# EAGLE design untitled_wifi (EAGLE 6.1)
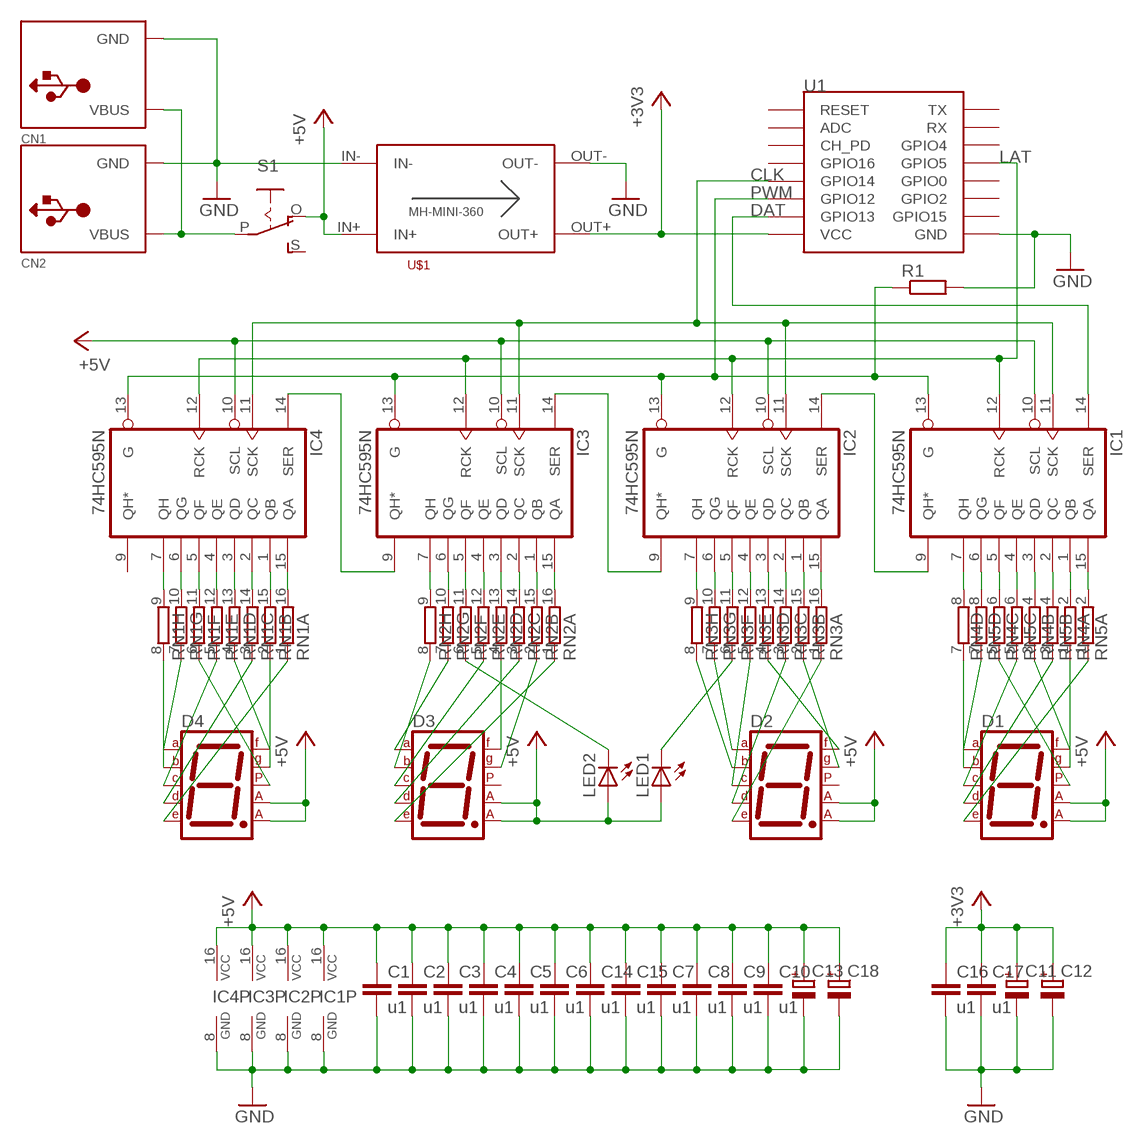
[diagram p0: schematic, sheet 1]

## Parts
C1  u1  C-EU025-025X050  [C025-025X050]
C2  u1  C-EU025-025X050  [C025-025X050]
C3  u1  C-EU025-025X050  [C025-025X050]
C4  u1  C-EU025-025X050  [C025-025X050]
C5  u1  C-EU025-025X050  [C025-025X050]
C6  u1  C-EU025-025X050  [C025-025X050]
C7  u1  C-EUC0805K  [C0805K]
C8  u1  C-EUC0805K  [C0805K]
C9  u1  C-EUC0805K  [C0805K]
C10  u1  C-EUC0805K  [C0805K]
C11  CPOL-EUTT2D4L  [TT2D4L]
C12  CPOL-EUTT2D4L  [TT2D4L]
C13  CPOL-EUE2.5-7  [E2,5-7]
C14  u1  C-EU025-025X050  [C025-025X050]
C15  u1  C-EU025-025X050  [C025-025X050]
C16  u1  C-EU025-025X050  [C025-025X050]
C17  u1  C-EU025-025X050  [C025-025X050]
C18  CPOL-EUE2.5-7  [E2,5-7]
CN1  USBPWR-ONLY  [USB-MINIB-THM]
CN2  USBPWR-ONLY  [USB-MINIB-THM]
D1  7SEG-CA  [7SEG-13]
D2  7SEG-CA  [7SEG-13]
D3  7SEG-CA  [7SEG-13]
D4  7SEG-CA  [7SEG-13]
IC1  74HC595N  [DIL16]
IC2  74HC595N  [DIL16]
IC3  74HC595N  [DIL16]
IC4  74HC595N  [DIL16]
LED1  LED3MM  [LED3MM]
LED2  LED3MM  [LED3MM]
R1  R-EU_0204/7  [0204/7]
RN1  8R-N  [DIL16]
RN2  8R-N  [DIL16]
RN3  8R-N  [DIL16]
RN4  E4R  [SIL8]
RN5  E4R  [SIL8]
S1  EG1218S  [EG1218]
U1  ESP12EDIP  [ESP-12-BREAKOUT]
U$1  DC-DC_CONV_MINISTD  [DC-DC_CONV_MINI]

## Nets
+3V3: C11.+ C12.+ C16.1 C17.1 U1.P$1(VCC) U$1.OUT+
+5V: C1.1 C2.1 C3.1 C4.1 C5.1 C6.1 C7.1 C8.1 C9.1 C10.1 C13.+ C14.1 C15.1 C18.+ D1.3(CA1) D1.8(CA2) D2.3(CA1) D2.8(CA2) D3.3(CA1) D3.8(CA2) D4.3(CA1) D4.8(CA2) IC1.10(SCL) IC1.16(VCC) IC2.10(SCL) IC2.16(VCC) IC3.10(SCL) IC3.16(VCC) IC4.10(SCL) IC4.16(VCC) LED1.A LED2.A S1.O U$1.IN+
CLK: IC1.11(SCK) IC2.11(SCK) IC3.11(SCK) IC4.11(SCK) U1.P$4(GPIO14)
DAT: IC1.14(SER) U1.P$2(GPIO13)
GND: C1.2 C2.2 C3.2 C4.2 C5.2 C6.2 C7.2 C8.2 C9.2 C10.2 C11.- C12.- C13.- C14.2 C15.2 C16.2 C17.2 C18.- CN1.GND CN1.GND1(GND) CN1.GND2(GND) CN1.GND3(GND) CN1.GND4(GND) CN2.GND CN2.GND1(GND) CN2.GND2(GND) CN2.GND3(GND) CN2.GND4(GND) IC1.8(GND) IC2.8(GND) IC3.8(GND) IC4.8(GND) R1.2 U1.P$9(GND) U$1.IN- U$1.OUT-
LAT: IC1.12(RCK) IC2.12(RCK) IC3.12(RCK) IC4.12(RCK) U1.P$13(GPIO5)
N$1: D1.7(A) RN5.7
N$2: D1.6(B) RN4.7
N$3: D1.5(DP) RN4.5
N$4: D1.4(C) RN5.5
N$5: D1.9(F) RN4.3
N$6: D1.2(D) RN5.3
N$7: D1.10(G) RN4.1
N$8: D1.1(E) RN5.1
N$9: D4.9(F) RN1.4
N$10: D2.1(E) RN3.1
N$11: D2.2(D) RN3.3
N$12: D2.4(C) RN3.5
N$13: D2.7(A) RN3.7
N$14: D2.6(B) RN3.8
N$15: LED2.K(C) RN2.6
N$16: D2.9(F) RN3.4
N$17: D2.10(G) RN3.2
N$18: D3.1(E) RN2.1
N$19: D3.2(D) RN2.3
N$20: D3.4(C) RN2.5
N$21: D3.7(A) RN2.7
N$22: D3.6(B) RN2.8
N$23: LED1.K(C) RN3.6
N$24: D3.9(F) RN2.4
N$25: D3.10(G) RN2.2
N$26: D4.1(E) RN1.1
N$27: D4.2(D) RN1.3
N$28: D4.4(C) RN1.5
N$29: D4.7(A) RN1.7
N$30: IC1.9(QH*) IC2.14(SER)
N$31: IC2.9(QH*) IC3.14(SER)
N$32: IC3.9(QH*) IC4.14(SER)
N$33: IC1.7(QH) RN4.8
N$34: IC1.15(QA) RN5.2
N$35: IC1.1(QB) RN4.2
N$36: IC1.2(QC) RN5.4
N$37: IC1.3(QD) RN4.4
N$38: IC1.4(QE) RN5.6
N$39: IC1.5(QF) RN4.6
N$40: IC1.6(QG) RN5.8
N$41: IC2.7(QH) RN3.9
N$42: IC2.15(QA) RN3.16
N$43: D4.6(B) RN1.8
N$44: D4.5(DP) RN1.6
N$45: D4.10(G) RN1.2
N$46: CN1.VBUS CN2.VBUS S1.P
N$50: IC3.15(QA) RN2.16
N$53: IC3.3(QD) RN2.13
N$55: IC3.5(QF) RN2.11
N$62: IC3.7(QH) RN2.9
N$76: IC4.7(QH) RN1.9
N$77: IC4.5(QF) RN1.11
N$78: IC4.6(QG) RN1.10
N$79: IC4.4(QE) RN1.12
N$80: IC4.3(QD) RN1.13
N$81: IC4.2(QC) RN1.14
N$82: IC4.1(QB) RN1.15
N$83: IC4.15(QA) RN1.16
N$91: IC2.1(QB) RN3.15
N$92: IC2.2(QC) RN3.14
N$93: IC2.3(QD) RN3.13
N$94: IC2.4(QE) RN3.12
N$95: IC2.5(QF) RN3.11
N$96: IC2.6(QG) RN3.10
N$97: IC3.1(QB) RN2.15
N$98: IC3.2(QC) RN2.14
N$99: IC3.4(QE) RN2.12
N$100: IC3.6(QG) RN2.10
PWM: IC1.13(G) IC2.13(G) IC3.13(G) IC4.13(G) R1.1 U1.P$3(GPIO12)
Unconnected: D2.5(DP) D3.5(DP) IC4.9(QH*) S1.S U1.P$5(GPIO16) U1.P$6(CH_PD) U1.P$7(ADC) U1.P$8(RESET) U1.P$10(GPIO15) U1.P$11(GPIO2) U1.P$12(GPIO0) U1.P$14(GPIO4) U1.P$15(RX) U1.P$16(TX)

## Library data of the parts
C1-C10 C14-C17 = rcl:C-EU: CAPACITOR, European symbol
C11-C13 C18 = rcl:CPOL-EU: POLARIZED CAPACITOR, European symbol
CN1 CN2 = _MY_OWN_LIB:USB: USB Connectors USBMINIB - Surface Mount Female Mini-B USB Connector 4UConnector: 06564 By microbuilder.eu Thru-hole RA Female Mini-B USB Connector 4UConnector: 18732 By ladyada.net
D1-D4 = special:7SEG-CA: 7-segment DISPLAY single anode, 13 mm
IC1-IC4 = 74xx-eu:74*595: 8-bit SHIFT REGISTER, output latch
LED1 LED2 = led:LED: LED OSRAM: - CHIPLED LG R971, LG N971, LY N971, LG Q971, LY Q971, LO R971, LY R971 LH N974, LH R974 LS Q976, LO Q976, LY Q976 LO Q996 - Hyper CHIPLED LW Q18S LB Q993, LB Q99A, LB R99A - SideLED LS A670, LO A670, LY A670, LG A670, LP A670 LB A673, LV A673, LT A673, LW A673 LH A674 LY A675 LS A676, LA A676, LO A676, LY A676, LW A676 LS A679, LY A679, LG A679 - Hyper Micro SIDELED® LS Y876, LA Y876, LO Y876, LY Y876 LT Y87S - SmartLED LW L88C, LW L88S LB L89C, LB L89S, LG L890 LS L89K, LO L89K, LY L89K LS L896, LA L896, LO L896, LY L896 - TOPLED LS T670, LO T670, LY T670, LG T670, LP T670 LSG T670, LSP T670, LSY T670, LOP T670, LYG T670 LG T671, LOG T671, LSG T671 LB T673, LV T673, LT T673, LW T673 LH T674 LS T676, LA T676, LO T676, LY T676, LB T676, LH T676, LSB T676, LW T676 LB T67C, LV T67C, LT T67C, LS T67K, LO T67K, LY T67K, LW E67C LS E67B, LA E67B, LO E67B, LY E67B, LB E67C, LV E67C, LT E67C LW T67C LS T679, LY T679, LG T679 LS T770, LO T770, LY T770, LG T770, LP T770 LB T773, LV T773, LT T773, LW T773 LH T774 LS E675, LA E675, LY E675, LS T675 LS T776, LA T776, LO T776, LY T776, LB T776 LHGB T686 LT T68C, LB T68C - Hyper Mini TOPLED® LB M676 - Mini TOPLED Santana® LG M470 LS M47K, LO M47K, LY M47K Source: http://www.osram.convergy.de LUXEON: - LUMILED® LXK2-PW12-R00, LXK2-PW12-S00, LXK2-PW14-U00, LXK2-PW14-V00 LXK2-PM12-R00, LXK2-PM12-S00, LXK2-PM14-U00 LXK2-PE12-Q00, LXK2-PE12-R00, LXK2-PE12-S00, LXK2-PE14-T00, LXK2-PE14-U00 LXK2-PB12-K00, LXK2-PB12-L00, LXK2-PB12-M00, LXK2-PB14-N00, LXK2-PB14-P00, LXK2-PB14-Q00 LXK2-PR12-L00, LXK2-PR12-M00, LXK2-PR14-Q00, LXK2-PR14-R00 LXK2-PD12-Q00, LXK2-PD12-R00, LXK2-PD12-S00 LXK2-PH12-R00, LXK2-PH12-S00 LXK2-PL12-P00, LXK2-PL12-Q00, LXK2-PL12-R00 Source: www.luxeon.com KINGBRIGHT: KA-3528ASYC Source: www.kingbright.com
R1 = rcl:R-EU_: RESISTOR, European symbol
RN1-RN3 = resistor-dil:8R-N: DIL RESISTOR; OC_FARNELL: unknown; OC_NEWARK: unknown
RN4 RN5 = resistor-sil:E4R: SIL RESISTOR; OC_FARNELL: unknown; OC_NEWARK: unknown
S1 = _MY_OWN_LIB:EG1218: SLIDING SWITCH 0.1" spacing through hole, vertical SPDT slide switch http://www.ladyada.net/library/pcb/eaglelibrary.html
U1 = _MY_OWN_LIB:ESP12E: ESP12E Module
U$1 = _MY_OWN_LIB:DC-DC_CONV_MINI

## Board
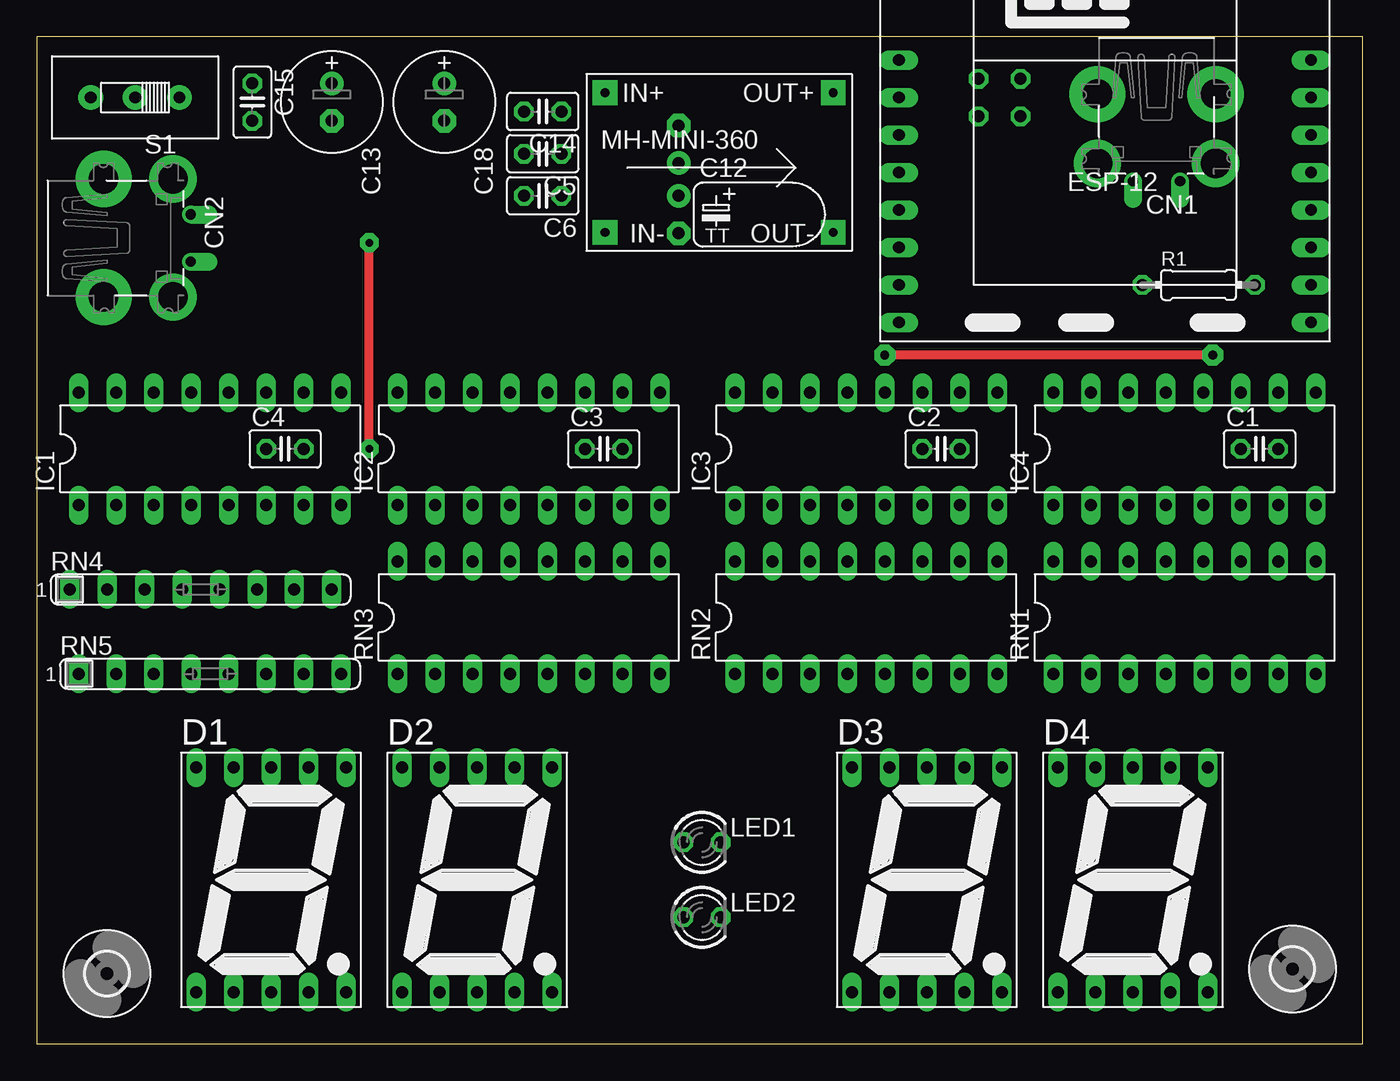
[diagram p1: board, top side]
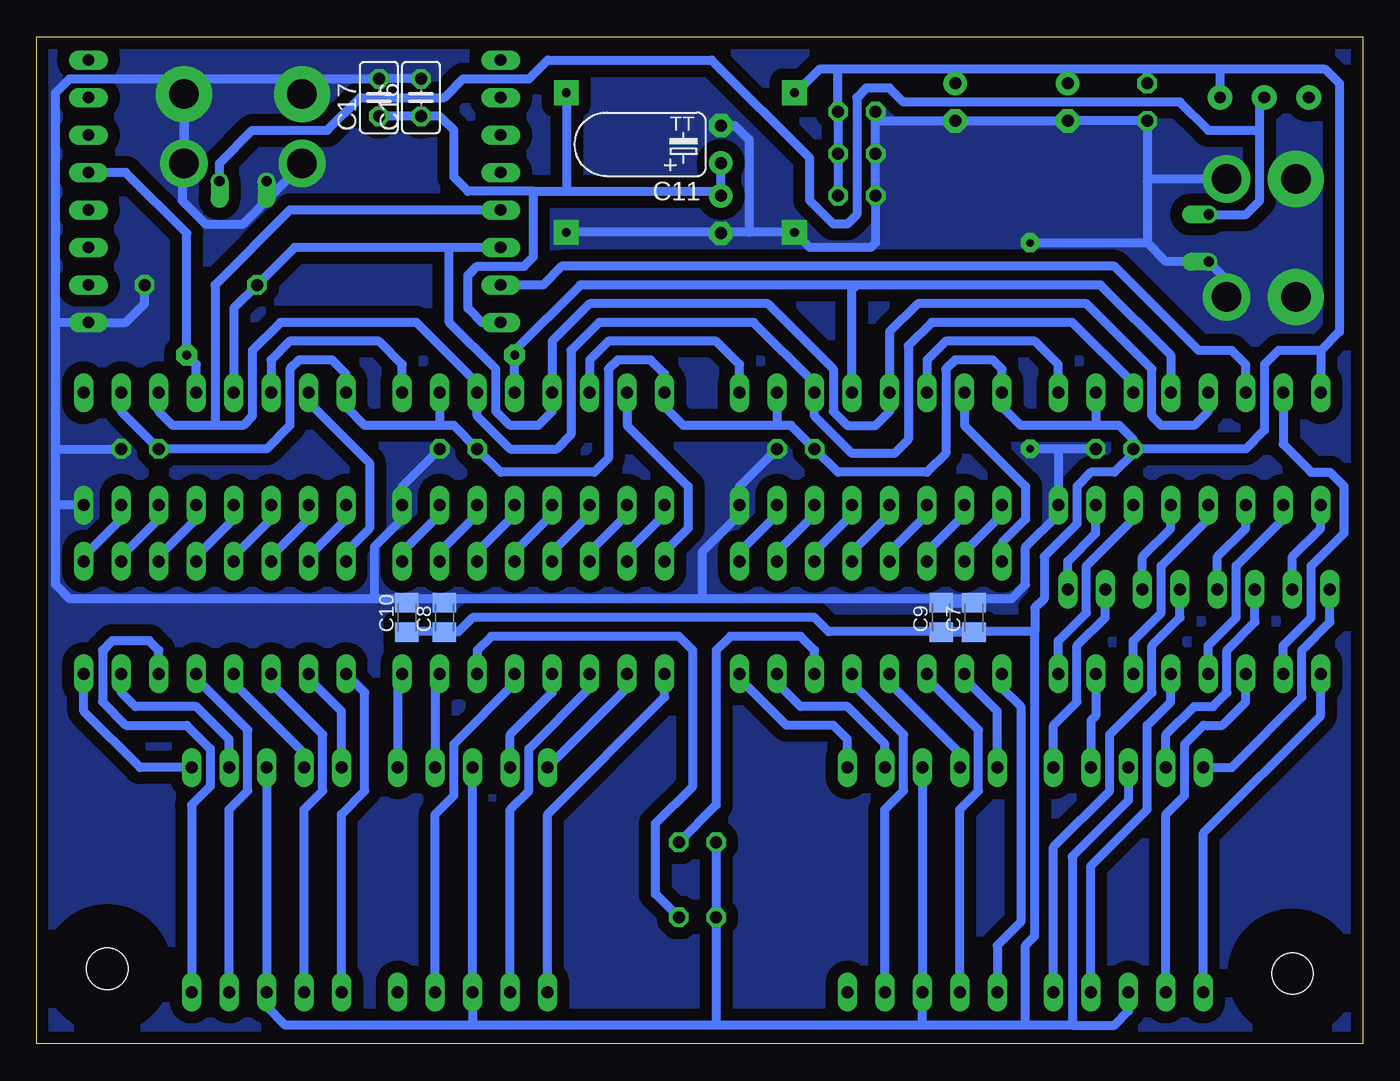
[diagram p2: board, bottom side, seen from below]

Size 89.84 x 68.24 mm. Coordinates in mm from the lower left corner, seen from the top.
Outline: 89.84,0 89.84,68.24 0,68.24 0,0 89.84,0
Copper layers (1*16): Top 0.035mm / dielectric 1.5mm / Bottom 0.035mm
Design rules: minimum track width 10mil, minimum drill 24mil, track to track 12mil, track to pad 12mil, pad to pad 12mil, via to via 12mil, smd to smd 10mil, copper to edge 12mil, drill to drill 12mil, minimum pad ring 10mil, minimum via ring 10mil, stop-mask expansion 4mil, vias tented up to drill 0mil, thermal gap 12mil

### Footprints (pad centres in the part's own frame; a part is rotated, then mirrored left to right if it is on the bottom)
C025-025X050 = drill 0.813 octagon: 1 -1.27,0; 2 1.27,0
C0805K = smd 1.3 x 1.6: 1 -1,0; 2 1,0
TT2D4L = drill 0.813 pad 1.6: + -1.27,0 | drill 0.813 pad 1.6 octagon: - 1.27,0
E2,5-7 = drill 0.813 pad 1.6: + -1.27,0 | drill 0.813 pad 1.6 octagon: - 1.27,0
USB-MINIB-THM = drill 0.7 offset: GND 1.6,9.8; VBUS -1.6,9.8 | drill 2 pad 3.81: GND1 -4,3.9; GND4 4,3.9 | drill 2 pad 3.2: GND2 -4,8.6; GND3 4,8.6
7SEG-13 = drill 0.813 long: 1 -5.08,-7.62; 2 -2.54,-7.62; 3 0,-7.62; 4 2.54,-7.62; 5 5.08,-7.62; 6 5.08,7.62; 7 2.54,7.62; 8 0,7.62; 9 -2.54,7.62; 10 -5.08,7.62
DIL16 = drill 0.813 long: 1 -8.89,-3.81; 2 -6.35,-3.81; 3 -3.81,-3.81; 4 -1.27,-3.81; 5 1.27,-3.81; 6 3.81,-3.81; 7 6.35,-3.81; 8 8.89,-3.81; 9 8.89,3.81; 10 6.35,3.81; 11 3.81,3.81; 12 1.27,3.81; 13 -1.27,3.81; 14 -3.81,3.81; 15 -6.35,3.81; 16 -8.89,3.81
LED3MM = drill 0.813 octagon: A -1.27,0; K 1.27,0
0204/7 = drill 0.813 octagon: 1 -3.81,0; 2 3.81,0
SIL8 = drill 0.813 long: 1 -8.89,0; 2 -6.35,0; 3 -3.81,0; 4 -1.27,0; 5 1.27,0; 6 3.81,0; 7 6.35,0; 8 8.89,0
EG1218 = drill 0.8 pad 1.676: O -3,0; P 0,0; S 3,0
ESP-12-BREAKOUT = drill 0.8 long: P$1 0,0; P$2 0,2.54; P$3 0,5.08; P$4 0,7.62; P$5 0,10.16; P$6 0,12.7; P$7 0,15.24; P$8 0,17.78; P$9 27.94,0; P$10 27.94,2.54; P$11 27.94,5.08; P$12 27.94,7.62; P$13 27.94,10.16; P$14 27.94,12.7; P$15 27.94,15.24; P$16 27.94,17.78
DC-DC_CONV_MINI = drill 0.6 pad 1.676 square: IN+ 16.73,1.27; IN- 16.73,10.73; OUT+ 1.27,1.27; OUT- 1.27,10.73
2,8 = hole 2.8: 0,0

### Placement (x,y rotation side)
C1  82.86,40.32 0 top
C2  61.27,40.32 0 top
C3  38.41,40.32 0 top
C4  16.81,40.32 0 top
C5  34.28,60.33 180 top
C6  34.28,57.47 180 top
C7  26.34,28.89 90 bottom
C8  62.22,28.89 90 bottom
C9  28.56,28.89 90 bottom
C10  64.76,28.89 90 bottom
C11  43.48,60.96 90 bottom
C12  43.48,56.2 270 top
C13  19.99,63.82 270 top
C14  34.28,63.18 180 top
C15  14.59,63.82 270 top
C16  63.8,64.14 90 bottom
C17  66.66,64.14 90 bottom
C18  27.61,63.82 270 top
CN1  75.87,68.26 180 top
CN2  0.62,54.61 270 top
D1  15.86,11.11 0 top
D2  29.83,11.11 0 top
D3  60.31,11.11 0 top
D4  74.28,11.11 0 top
IC1  11.74,40.32 0 top
IC2  33.33,40.32 0 top
IC3  56.19,40.32 0 top
IC4  77.78,40.32 0 top
LED1  45.07,13.65 0 top
LED2  45.07,8.57 0 top
R1  78.73,51.44 0 top
RN1  77.78,28.89 0 top
RN2  56.19,28.89 0 top
RN3  33.33,28.89 0 top
RN4  11.1,30.8 0 top
RN5  11.74,25.08 0 top
S1  6.65,64.14 180 top
U1  58.41,48.9 0 top
U$1  55.23,65.72 180 top
U$2  [2,8]  4.75,4.76 0 top
U$3  [2,8]  85.08,5.08 0 top

### Tracks (layer width: path | path; a pad name or v marks a point on that pad's centre or on a via)
+3V3
  Bottom 0.61: U1.P$1 59.68,48.9 60.63,49.85 60.63,52.07 60,52.7 56.82,52.7 56.18,53.34 56.18,57.78 | C11.+ C12.+ 43.8,57.78 53.96,57.78 | 56.18,57.78 53.96,57.78 | 56.18,57.78 60.63,57.78 61.58,58.74 61.58,61.91 62.54,62.87 C16.1 C17.1 | U$1.OUT+ 53.96,57.78
+5V
  Bottom 0.61: 2.85,46.99 IC1.16 | D1.8 15.86,16.51 19.67,12.7 19.67,1.27 | 19.67,1.27 16.81,1.27 15.86,2.22 D1.3 | 22.85,1.27 29.83,1.27 | 29.83,1.27 D2.3 D2.8 | 29.83,1.27 43.8,1.27 | 43.8,1.27 60.31,1.27 | 60.31,1.27 D3.3 D3.8 | D4.8 D4.3 74.28,2.54 73.01,1.27 60.31,1.27 | LED2.A LED1.A 43.8,1.27 | C4.1 15.54,40.01 16.81,38.73 18.4,38.73 19.36,37.78 19.36,35.24 21.58,33.02 21.58,30.16 22.21,29.53 22.21,27.94 | 19.67,1.27 22.85,1.27 | 22.85,1.27 22.85,6.67 22.21,7.3 22.21,27.94 | 2.85,46.99 5.7,46.99 6.65,46.04 6.65,41.59 7.93,40.32 C4.1 | C4.1 15.54,40.96 16.5,41.91 18.08,41.91 | 18.08,41.91 23.17,41.91 24.43,43.18 IC2.16 24.43,45.72 25.07,46.35 27.61,46.35 28.24,45.72 28.24,40.01 29.51,38.73 35.55,38.73 C3.1 38.72,41.91 39.68,41.91 | IC1.10 18.08,41.91 | 39.68,41.91 46.03,41.91 47.29,43.18 IC3.16 47.29,45.4 48.25,46.35 50.47,46.35 51.11,45.72 51.11,39.69 52.06,38.73 58.41,38.73 C2.1 61.58,41.91 62.54,41.91 | IC2.10 39.68,41.91 | 62.54,41.91 67.62,41.91 68.89,43.18 IC4.16 68.89,45.4 69.84,46.35 72.06,46.35 72.7,45.72 72.7,41.91 74.28,40.32 C1.1 84.12,42.86 IC4.10 | IC3.10 62.54,41.91 | 22.21,27.94 28.56,27.94 | 28.56,27.94 36.18,27.94 37.14,28.89 60.31,28.89 61.26,27.94 62.17,27.94 | 62.17,27.94 64.76,27.94 C10.1 | 28.56,27.94 28.51,27.89 C7.1 C9.1 | 62.17,27.94 C8.1 | 2.85,46.99 1.58,48.26 1.58,65.09 2.53,66.04 9.51,66.04 | U$1.IN+ 38.4,64.45 36.82,66.04 35.55,66.04 | C6.1 C5.1 C14.1 35.55,66.04 | 9.51,66.04 14.59,66.04 | 14.59,66.04 19.99,66.04 | 19.99,66.04 27.61,66.04 | 27.61,66.04 35.55,66.04 | C18.+ 27.61,66.04 | C13.+ 19.99,66.04 | C15.1 14.59,66.04 | S1.O 9.66,65.9 9.51,66.04
CLK
  Bottom 0.61: IC1.11 15.54,44.77 19.67,48.9 29.2,48.9 30.79,47.31 30.79,40.96 31.74,40.01 34.59,40.01 37.14,42.55 IC2.11 37.14,44.77 41.26,48.9 51.74,48.9 53.65,46.99 53.65,41.27 54.6,40.32 57.77,40.32 60,42.55 IC3.11 60,44.77 64.12,48.9 73.33,48.9 75.23,46.99 75.23,42.55 75.87,41.91 77.78,41.91 | 77.78,41.91 80.63,41.91 81.59,42.86 IC4.11 | U1.P$4 72.7,56.52 77.78,51.44 77.78,41.91
DAT
  Bottom 0.61: IC1.14 7.93,46.04 8.88,46.99 11.1,46.99 16.81,52.7 54.28,52.7 55.55,51.44 U1.P$2
GND  (via drill 0.5 pad 1.27)
  Top 0.61: v22.53,40.32 v22.53,54.29
  Bottom 0.61: C3.2 42.22,37.78 IC2.8 42.22,35.88 44.76,33.34 44.76,30.16 | 66.98,30.16 66.98,33.66 65.08,35.56 IC3.8 65.08,37.78 C2.2 | 66.98,30.16 87.62,30.16 88.57,31.11 88.57,36.51 | 44.76,30.16 62.22,30.16 | 62.22,30.16 64.76,30.16 | 64.76,30.16 66.98,30.16 | 26.34,30.16 23.8,30.16 22.85,31.11 22.85,33.66 20.63,35.88 IC1.8 20.63,40.32 | 26.34,30.16 44.76,30.16 | IC4.8 88.57,36.51 | C9.2 C7.2 26.34,30.16 | C8.2 62.22,30.16 | C10.2 64.76,30.16 | R1.2 82.54,50.16 83.81,48.9 U1.P$9 88.57,48.9 | 88.57,40.32 C1.2 | 88.57,36.51 88.57,40.32 | 88.57,40.32 88.57,48.9 | 88.57,48.9 88.57,64.45 87.62,65.41 79.68,65.41 | 79.68,65.41 72.06,65.41 | 72.06,65.41 C17.2 C16.2 | 41.58,54.99 U$1.IN- 38.4,55.09 | 41.58,54.99 43.48,54.99 | 43.48,54.99 53.9,54.99 53.96,54.93 | C12.- 43.48,54.99 | C4.2 20.63,40.32 | CN2.GND 10.42,52.98 9.19,51.75 9.19,50.64 CN2.GND3 | 41.58,54.99 41.58,61.28 42.53,62.23 C11.- | 38.4,54.93 37.45,53.98 33.33,53.98 33.01,54.29 C6.2 C5.2 C14.2 33.01,62.55 C18.- C13.- C15.2 14.59,58.42 | 14.59,54.29 13.32,53.02 10.78,53.02 | 14.59,58.42 14.59,54.29 | 20.63,40.32 v22.53,40.32 | v22.53,54.29 14.59,54.29 | CN2.GND2 14.4,58.61 14.59,58.42 | CN1.GND4 71.87,65.22 72.06,65.41 | CN1.GND1 79.87,59.82 80,59.69 80,57.15 78.41,55.56 75.87,55.56 73.65,57.78 | CN1.GND2 79.87,65.22 79.68,65.41 | 73.65,57.78 71.87,59.56 CN1.GND3 | CN1.GND 74.27,58.41 73.65,57.78
  pour Bottom (isolate 0.813, no thermals): -0.01,0 89.84,0 89.84,68.26 -0.01,68.26
LAT  (via drill 0.6 pad 1.42)
  Top 0.61: v79.68,46.67 v57.46,46.67
  Bottom 0.61: IC3.12 v57.46,46.67 57.46,46.99 53.01,51.44 34.59,51.44 | U1.P$13 83.81,59.05 79.68,54.93 v79.68,46.67 79.04,46.04 IC4.12 | 34.28,51.44 17.77,51.44 13.01,46.67 IC1.12 | 34.28,51.44 34.59,51.44 | 34.59,51.44 34.59,51.12 | IC2.12 34.59,51.12 | 34.59,51.12 34.28,51.44
N$1
  Bottom 0.61: RN5.7 18.08,22.23 18.4,21.91 D1.7
N$2
  Bottom 0.61: D1.6 20.94,21.59 19.36,23.18 19.36,26.99 17.45,28.89 RN4.7
N$3
  Bottom 0.61: D1.5 20.94,13.34 17.13,17.14 17.13,20.95 14.27,23.81 14.27,26.99 12.37,28.89 RN4.5
N$4
  Bottom 0.61: D1.4 18.4,12.06 14.59,15.88 14.59,21.59 13.01,23.18 RN5.5
N$5
  Bottom 0.61: D1.9 13.32,20.95 11.42,22.86 10.15,22.86 9.19,23.81 9.19,26.67 7.29,28.57 RN4.3
N$6
  Bottom 0.61: D1.2 13.32,15.56 12.05,16.83 12.05,20.32 10.78,21.59 9.51,21.59 7.93,23.18 RN5.3
N$7
  Bottom 0.61: D1.10 8.88,18.73 4.12,23.5 4.12,26.67 2.21,28.57 RN4.1
N$8
  Bottom 0.61: D1.1 10.78,14.29 2.85,22.23 RN5.1
N$9
  Bottom 0.61: D4.9 71.74,19.68 76.5,24.45 RN1.4
N$10
  Bottom 0.61: RN3.1 24.43,24.13 23.17,22.86 23.17,8.26 24.75,6.67 D2.1
N$11
  Bottom 0.61: D2.2 27.29,15.88 26.02,17.14 26.02,21.27 29.51,24.77 RN3.3
N$12
  Bottom 0.61: D2.4 32.37,15.88 31.1,17.14 31.1,20.95 34.59,24.45 RN3.5
N$13
  Bottom 0.61: D2.7 32.37,20.32 34.91,22.86 38.09,22.86 39.68,24.45 RN3.7
N$14
  Bottom 0.61: D2.6 34.91,20.64 35.86,21.59 39.04,21.59 42.22,24.77 RN3.8
N$15
  Bottom 0.61: LED2.K 47.93,10.16 47.93,14.92 45.39,17.46 45.39,26.67 46.34,27.62 59.04,27.62 60,26.67 RN2.6
N$16
  Bottom 0.61: D2.9 27.29,19.68 32.06,24.45 RN3.4 32.06,24.77
N$17
  Bottom 0.61: D2.10 24.75,22.54 26.97,24.77 RN3.2
N$18
  Bottom 0.61: D3.1 55.23,15.56 47.29,23.5 RN2.1
N$19
  Bottom 0.61: D3.2 57.77,15.88 56.5,17.14 56.5,20 52.37,24.13 RN2.3
N$20
  Bottom 0.61: D3.4 62.85,15.56 61.58,16.83 61.58,20.32 57.46,24.45 RN2.5
N$21
  Bottom 0.61: RN2.7 62.85,24.77 D3.7
N$22
  Bottom 0.61: RN2.8 65.39,24.77 D3.6
N$23
  Bottom 0.61: RN3.6 37.14,26.67 38.09,27.62 42.85,27.62 43.8,26.67 43.8,16.19 LED1.K
N$24
  Bottom 0.61: D3.9 57.77,20.95 54.91,23.81 RN2.4
N$25
  Bottom 0.61: D3.10 49.83,24.13 RN2.2
N$26
  Bottom 0.61: D4.1 69.2,15.56 67.62,17.14 67.62,23.81 RN1.1
N$27
  Bottom 0.61: D4.2 71.74,15.88 70.47,17.14 70.47,20.95 73.97,24.45 RN1.3
N$28
  Bottom 0.61: D4.4 76.82,15.88 75.55,17.14 75.55,21.27 79.04,24.77 RN1.5
N$29
  Bottom 0.61: D4.7 76.82,20.64 79.04,22.86 83.17,22.86 84.12,23.81 RN1.7
N$30
  Bottom 0.61: IC1.9 20.63,46.04 22.21,47.62 28.24,47.62 29.51,46.35 IC2.14
N$31
  Bottom 0.61: IC2.9 42.22,46.04 43.8,47.62 51.11,47.62 52.37,46.35 IC3.14
N$32
  Bottom 0.61: IC3.9 65.08,46.04 66.66,47.62 72.7,47.62 73.97,46.35 IC4.14
N$33
  Bottom 0.61: RN4.8 19.99,32.7 18.08,34.61 IC1.7
N$34
  Bottom 0.61: IC1.15 5.39,40.64 3.48,38.73 2.21,38.73 1.26,37.78 1.26,34.61 3.48,32.38 3.48,28.89 5.39,26.99 RN5.2
N$35
  Bottom 0.61: RN4.2 4.75,33.02 2.85,34.92 IC1.1
N$36
  Bottom 0.61: RN5.4 10.46,26.99 8.56,28.89 8.56,32.38 5.39,35.56 IC1.2
N$37
  Bottom 0.61: RN4.4 9.83,33.02 7.93,34.92 IC1.3
N$38
  Bottom 0.61: RN5.6 15.54,27.3 13.64,29.21 13.64,32.38 10.46,35.56 IC1.4
N$39
  Bottom 0.61: RN4.6 14.91,33.02 13.01,34.92 IC1.5
N$40
  Bottom 0.61: RN5.8 20.63,27.3 18.72,29.21 18.72,32.38 15.54,35.56 IC1.6
N$41
  Bottom 0.61: RN3.9 42.22,33.34 39.68,35.88 IC2.7
N$42
  Bottom 0.61: IC2.15 26.97,41.91 22.85,37.78 22.85,35.56 24.43,33.97 RN3.16
N$43
  Bottom 0.61: D4.6 82.86,18.73 86.67,22.54 RN1.8
N$44
  Bottom 0.61: RN1.6 81.59,26.67 82.22,27.3 84.76,27.3 85.39,26.67 85.39,23.18 83.81,21.59 79.68,21.59 78.09,20 78.09,17.46 79.36,16.19 D4.5
N$45
  Bottom 0.61: D4.10 69.2,22.54 71.42,24.77 RN1.2
N$46
  Bottom 0.61: S1.P 6.97,63.82 6.97,61.91 | CN1.VBUS 77.47,59.68 75.23,61.91 70.15,61.91 67.93,64.14 62.22,64.14 60.95,65.41 56.5,65.41 55.23,66.67 44.12,66.67 37.45,60.01 37.45,57.15 35.86,55.56 34.91,55.56 34.28,56.2 34.28,64.14 33.64,64.77 32.06,64.77 31.1,63.82 12.37,63.82 10.46,61.91 6.97,61.91 | CN2.VBUS 7.91,56.21 6.97,57.15 6.97,61.91
N$50
  Bottom 0.61: IC3.15 49.83,41.91 45.71,37.78 45.71,34.92 47.29,33.34 RN2.16
N$53
  Bottom 0.61: RN2.13 54.91,33.34 52.37,35.88 IC3.3
N$55
  Bottom 0.61: RN2.11 60,33.34 57.46,35.88 IC3.5
N$62
  Bottom 0.61: RN2.9 65.08,33.34 62.54,35.88 IC3.7
N$76
  Bottom 0.61: RN1.9 86.67,33.02 84.12,35.56 IC4.7
N$77
  Bottom 0.61: RN1.11 81.59,33.02 79.04,35.56 IC4.5
N$78
  Bottom 0.61: RN1.10 84.12,33.02 81.59,35.56 IC4.6
N$79
  Bottom 0.61: RN1.12 79.04,33.02 76.5,35.56 IC4.4
N$80
  Bottom 0.61: RN1.13 76.5,33.02 73.97,35.56 IC4.3
N$81
  Bottom 0.61: RN1.14 73.97,33.02 71.42,35.56 IC4.2
N$82
  Bottom 0.61: RN1.15 71.42,33.02 68.89,35.56 IC4.1
N$83
  Bottom 0.61: IC4.15 71.42,43.5 67.3,39.37 67.3,34.92 68.89,33.34 RN1.16
N$91
  Bottom 0.61: RN3.15 26.97,33.34 24.43,35.88 IC2.1
N$92
  Bottom 0.61: IC2.2 26.97,35.88 29.51,33.34 RN3.14
N$93
  Bottom 0.61: RN3.13 32.06,33.34 29.51,35.88 IC2.3
N$94
  Bottom 0.61: RN3.12 34.59,33.34 32.06,35.88 IC2.4
N$95
  Bottom 0.61: RN3.11 37.14,33.34 34.59,35.88 IC2.5
N$96
  Bottom 0.61: RN3.10 39.68,33.34 37.14,35.88 IC2.6
N$97
  Bottom 0.61: RN2.15 49.83,33.34 47.29,35.88 IC3.1
N$98
  Bottom 0.61: RN2.14 52.37,33.34 49.83,35.88 IC3.2
N$99
  Bottom 0.61: RN2.12 57.46,33.34 54.91,35.88 IC3.4
N$100
  Bottom 0.61: RN2.10 62.54,33.34 60,35.88 IC3.6
PWM
  Bottom 0.61: IC1.13 10.46,42.86 11.42,41.91 13.64,41.91 14.27,42.55 14.27,45.72 18.72,50.16 30.15,50.16 32.06,48.26 IC2.13 32.06,42.86 33.01,41.91 34.91,41.91 35.86,42.86 35.86,45.72 40.31,50.16 52.37,50.16 54.91,47.62 IC3.13 54.91,42.86 55.87,41.91 57.77,41.91 58.72,42.86 58.72,45.72 61.9,48.9 61.9,53.98 | U1.P$3 61.9,53.98 | 61.9,53.98 72.38,53.98 R1.1 76.5,49.85 IC4.13